# Altium schematic sheet Phase_Detector.SchDoc: Phase detector
size A3; Author: M.Beldyga; CompanyName: WUT ISE; DrawnBy: M.Beldyga; Organization: WUT ISE; Address1: PW ISE; Address2: Nowowiejska 15/19 00-665 Warsaw; Address3: micbeldyga@gmail.com; SheetNumber: 12; SheetTotal: 12; ModifiedBy: -; CheckedDate: -; DivGrp: WUT ISE; Designer: M.Beldyga; ModifiedDate: -; ProjectName: Sensor Box
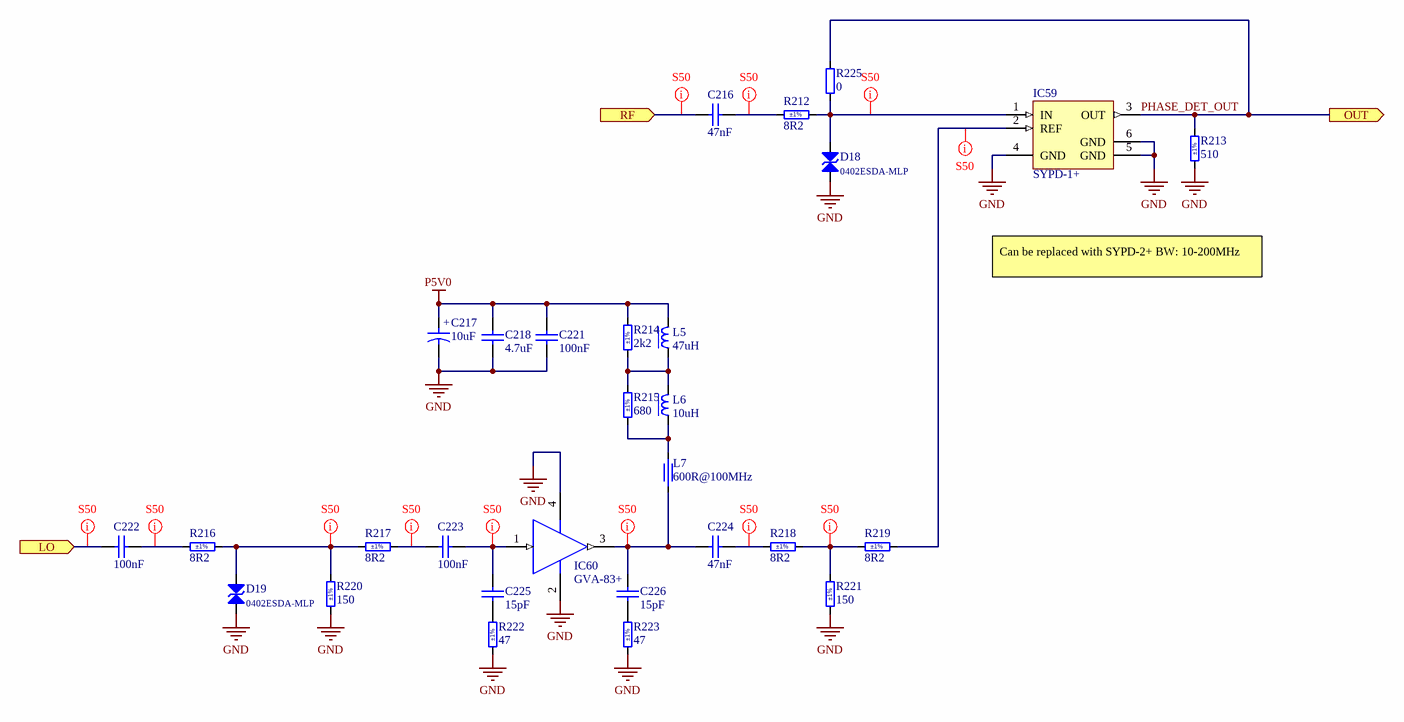
[diagram p0: Phase_Detector.SchDoc]

## Parts
C216  47nF  [CAPC1005X55N]
C217  10uF  [CAPMP3216X180N]
C218  4.7uF  [CAPC1608X90N]
C221  100nF  [CAPC1005X55N]
C222  100nF  [CAPC1005X55N]
C223  100nF  [CAPC1005X55N]
C224  47nF  [CAPC1005X55N]
C225  15pF  [CAPC1005X55N]
C226  15pF  [CAPC1005X55N]
D18  0402ESDA-MLP  [EATON_0402ESDA-MLP]
D19  0402ESDA-MLP  [EATON_0402ESDA-MLP]
IC59  SYPD-1+  [MINI-CIRCUITS_TTT167]
IC60  GVA-83+  [MINI-CIRCUITS_DF782]
L5  47uH  [IND_MURATA_LQH32C]
L6  10uH  [IND_MURATA_LQH32C]
L7  600R@100MHz  [INDC1608X95N]
R212  8R2  Tolerance: ±1%  [RESC2012X60N]
R213  510  Tolerance: ±1%  [RESC1005X40N]
R214  2k2  Tolerance: ±1%  [RESC1005X40N]
R215  680  Tolerance: ±1%  [RESC1005X40N]
R216  8R2  Tolerance: ±1%  [RESC2012X60N]
R217  8R2  Tolerance: ±1%  [RESC2012X60N]
R218  8R2  Tolerance: ±1%  [RESC2012X60N]
R219  8R2  Tolerance: ±1%  [RESC2012X60N]
R220  150  Tolerance: ±1%  [RESC2012X60N]
R221  150  Tolerance: ±1%  [RESC2012X60N]
R222  47  Tolerance: ±1%  [RESC1005X40N]
R223  47  Tolerance: ±1%  [RESC1005X40N]
R225  0  [RESC1005X40N]

## Ports
LO (in), OUT (out), RF (in)

## Nets
GND: C217.2 C218.1 C221.2 D18.1 D19.1 IC59.4(GND) IC59.5(GND) IC59.6(GND) IC60.2(GND) IC60.4(GND) R213.1 R220.1 R221.1 R222.1 R223.1
P5V0: C217.1 C218.2 C221.1 L5.2 R214.2
LO: C222.2 ; port LO
PHASE_DET_OUT: IC59.3(OUT) R213.2 R225.2 ; port OUT
RF: C216.1 ; port RF
NetC216_2: C216.2 R212.1
NetC222_1: C222.1 R216.1
NetC223_1: C223.1 C225.2 IC60.1(RF_IN)
NetC223_2: C223.2 R217.2
NetC224_1: C224.1 C226.2 IC60.3(RF_OUT) L7.1
NetC224_2: C224.2 R218.1
NetC225_1: C225.1 R222.2
NetC226_1: C226.1 R223.2
NetD18_2: D18.2 IC59.1(IN) R212.2 R225.1
NetD19_2: D19.2 R216.2 R217.1 R220.2
NetIC59_2: IC59.2(REF) R219.2
NetL5_1: L5.1 L6.2 R214.1 R215.2
NetL6_1: L6.1 L7.2 R215.1
NetR218_2: R218.2 R219.1 R221.2

## Layout directives
net class S50: LO, NetC216_2, NetC222_1, NetC223_1, NetC223_2, NetC224_1, NetC224_2, NetD18_2, NetD19_2, NetIC59_2, NetR218_2, RF

## Notes on the sheet
- Can be replaced with SYPD-2+ BW: 10-200MHz
- Project/Equipment
- Document
- Designer
- Drawn by
- Check.by
- Contact
- File
- Last Mod.
- Print Date
- Sheet
- Size
- A3
- of
- Rev
- (in symbol CTE3216-18_10UF_10V_10%_LESR1800) +

## Library data of the parts
C216 C224 = CC0402_47NF_25V_10%_X7R: Non-polarised capacitor; Part Description: SMD Multilayer Chip Ceramic Capacitor; Manufacturer: GENERIC; Manufacturer1 Part Number: C1005X7R1E473K050; Voltage: 25V; TC: X7R; Tolerance: ±10%; Part Number: CC0402_47NF_25V_10%_X7R; Component Kind: Standard; Component Type: Standard; Pin Count: 2; Value: 47nF; Status: Preferred; Manufacturer Part Number: CC0402_47NF_25V_10%_X7R; Case: 0402; Mounted: Yes; Socket: No; SMD: Yes; Sense: No; Manufacturer1 Example: TDK; Manufacturer1 ComponentHeight: 0.55mm; HelpURL: \\cern.ch\dfs\Applications\Altium\Datasheets\CC0402_X7R_TDK_C.pdf; Author: CERN DEM JLC; CreateDate: 10/25/2012; LatestRevisionDate: 10/25/2012
C217 = CTE3216-18_10UF_10V_10%_LESR1800: Polarised capacitor; Part Description: Low ESR 1R8 Solid Tantalum Chip Capacitor; Manufacturer: GENERIC; Manufacturer1 Part Number: TPSA106K010R1800; Voltage: 10V; Tolerance: ±10%; Part Number: CTE3216-18_10UF_10V_10%_LESR1800; Component Kind: Standard; Component Type: Standard; Pin Count: 2; Value: 10uF; Status: Preferred; Manufacturer Part Number: CTE3216-18_10UF_10V_10%_LESR1800; Case: A; Mounted: Yes; Socket: No; SMD: Yes; Sense: No; Manufacturer1 Example: AVX; Manufacturer1 ComponentHeight: 1.8mm; HelpURL: \\cern.ch\dfs\Applications\Altium\Datasheets\CTE-LESR_AVX_TPS.pdf; Author: CERN DEM JLC; CreateDate: 5/5/2008; LatestRevisionDate: 1/20/2009
C218 = CC0603_4.7UF_25V_10%_X5R: Non-polarised capacitor; Part Description: SMD Multilayer Chip Ceramic Capacitor; Manufacturer: GENERIC; Manufacturer1 Part Number: GRM188R61E475KE11D; Voltage: 25V; TC: X5R; Tolerance: ±10%; Part Number: CC0603_4.7UF_25V_10%_X5R; Component Kind: Standard; Component Type: Standard; Pin Count: 2; Value: 4.7uF; Status: None; Manufacturer Part Number: CC0603_4.7UF_25V_10%_X5R; Case: 0603; Mounted: Yes; Socket: No; SMD: Yes; Sense: No; Manufacturer1 Example: MURATA; Manufacturer1 ComponentHeight: 0.95mm; HelpURL: \\cern.ch\dfs\Applications\Altium\Datasheets\CC0603_MURATA_GRM188R61E475KE11D.pdf; Author: CERN DEM JLC; CreateDate: 11/10/2014; LatestRevisionDate: 11/10/2014
C221-C223 = CC0402_100NF_50V_10%_X7R: Non-polarised capacitor; Part Description: SMD Multilayer Chip Ceramic Capacitor; Manufacturer: GENERIC; Manufacturer1 Part Number: GRM155R71H104KE14D; Voltage: 50V; TC: X7R; Tolerance: ±10%; Part Number: CC0402_100NF_50V_10%_X7R; Component Kind: Standard; Component Type: Standard; Pin Count: 2; Value: 100nF; Status: None; Manufacturer Part Number: CC0402_100NF_50V_10%_X7R; Case: 0402; Mounted: Yes; Socket: No; SMD: Yes; Sense: No; Manufacturer1 Example: MURATA; Manufacturer1 ComponentHeight: 0.55mm; HelpURL: \\cern.ch\dfs\Applications\Altium\Datasheets\CC0402_MURATA_GRM155R71H104KE14D.pdf; Author: CERN DEM MR; CreateDate: 6/30/2017; LatestRevisionDate: 6/30/2017
C225 C226 = CC0402_15PF_50V_5%_C0G: Non-polarised capacitor; Part Description: SMD Multilayer Chip Ceramic Capacitor; Manufacturer: GENERIC; Manufacturer1 Part Number: C0402C150J5GACTU; Voltage: 50V; TC: C0G/NP0; Tolerance: ±5%; Part Number: CC0402_15PF_50V_5%_C0G; Component Kind: Standard; Component Type: Standard; Pin Count: 2; Value: 15pF; Status: Preferred; Manufacturer Part Number: CC0402_15PF_50V_5%_C0G; Case: 0402; Mounted: Yes; Socket: No; SMD: Yes; Sense: No; Manufacturer1 Example: KEMET; Manufacturer1 ComponentHeight: 0.55mm; HelpURL: \\cern.ch\dfs\Applications\Altium\Datasheets\CC0402_C0G_KEMET_(Commercial Grade).pdf; Author: CERN DEM JLC; CreateDate: 12/3/2007; LatestRevisionDate: 4/22/2015
D18 D19 = 0402ESDA-MLP: Transient Voltage Suppressor Diode (Bi-Directional); Part Description: 0.05pF 8kV Bidirectional ESD Voltage Suppressor; Manufacturer: EATON; Voltage: 8kV; PressFit: No; Bonding: No; Part Number: 0402ESDA-MLP; Component Kind: Standard; Component Type: Standard; Device: 0402ESDA-MLP; PackageDescription: 0402, 2-Leads, Body 1.1mm L X 0.53mm W X 0.44mm H body, IPC Medium Density; Manufacturer Part Number: 0402ESDA-MLP; Pin Count: 2; Case: 0402; Mounted: Yes; Socket: No; SMD: Yes; Sense: No; ComponentHeight: 0.44mm; HelpURL: \\cern.ch\dfs\Applications\Altium\Datasheets\0402ESDA-MLP.pdf; Author: CERN DEM MR; CreateDate: 11/22/2019; LatestRevisionDate: 11/22/2019
IC59 = SYPD-1+: 50 Ohm, 1 to 100MHz, High Output, Phase Detector; Manufacturer: MINI-CIRCUITS; Manufacturer Part Number: SYPD-1; PressFit: No; Bonding: No; Part Number: SYPD-1+; Component Kind: Standard; Component Type: Standard; Device: SYPD-1+; PackageDescription: MINI-CIRCUITS TTT167 Case, 6 pin, 9.65mm W X 12.7mm L; Part Description: 50 Ohm, 1 to 100MHz, High Output, Phase Detector; Pin Count: 6; Mounted: Yes; Socket: No; SMD: Yes; Sense: No; ComponentHeight: 5.84mm; Author: CERN DEM BC; HelpURL: \\cern.ch\dfs\Applications\Altium\Datasheets\SYPD-1+.pdf; CreateDate: 1/23/2020; LatestRevisionDate: 6/24/2022
IC60 = GVA-83+: Monolithic Amplifier DC-7 GHz; Manufacturer: Mini-Circuits; Supplier: Digikey; Supplier Part Number: 3157-GVA-83+CT-ND; Manufacturer Part Number: GVA-83+; RoHS: Yes; Category: RF Amplifiers; Stock: 563; Pricing: 1=3.04, 20=2.76, 100=2.724, 200=2.592, 500=2.5857 (USD); RoHS Compliant: Yes; ComponentLink1URL: http://datasheet.octopart.com/GVA-83%2B-Mini-Circuits-datasheet-15989876.pdf?src-supplier=Digikey; ComponentLink1Description: http://datasheet.octopart.com/GVA-83%2B-Mini-Circuits-datasheet-15989876.pdf?src-supplier=Digikey; ComponentLink2URL: http://datasheet.octopart.com/GVA-83%2B-Mini-Circuits-datasheet-15989876.pdf?src-supplier=Mouser; ComponentLink2Description: http://datasheet.octopart.com/GVA-83%2B-Mini-Circuits-datasheet-15989876.pdf?src-supplier=Mouser; ComponentLink3URL: http://datasheet.octopart.com/GVA-83%2B-Mini-Circuits-datasheet-15989876.pdf?src-supplier=Quest; ComponentLink3Description: http://datasheet.octopart.com/GVA-83%2B-Mini-Circuits-datasheet-15989876.pdf?src-supplier=Quest
L5 = IND_47UH_10%_MURATA_LQH32CN470K23L: Inductor With Core; Part Description: Chip Inductor (Chip Coil) for Choke Wire Wound Type; Manufacturer: MURATA; Power: 170mA; Resistance: 1.3R; Tolerance: ±10%; Part Number: IND_47UH_10%_MURATA_LQH32CN470K23L; Component Kind: Standard; Component Type: Standard; Pin Count: 2; Value: 47uH; Manufacturer Part Number: LQH32CN470K23; Mounted: Yes; Socket: No; SMD: Yes; Sense: No; ComponentHeight: 2.2mm; HelpURL: \\cern.ch\dfs\Applications\Altium\Datasheets\IND_MURATA_LQH32CN_23.pdf; Author: CERN DEM JLC; CreateDate: 1/20/2009; LatestRevisionDate: 7/4/2018
L6 = IND_10UH_10%_MURATA_LQH32CN100K33L: Inductor With Core; Part Description: Chip Inductor (Chip Coil) for Choke Wire Wound Type; Manufacturer: MURATA; Power: 450mA; Resistance: 0.3R; Tolerance: ±10%; Part Number: IND_10UH_10%_MURATA_LQH32CN100K33L; Component Kind: Standard; Component Type: Standard; Pin Count: 2; Value: 10uH; Manufacturer Part Number: LQH32CN100K33; Mounted: Yes; Socket: No; SMD: Yes; Sense: No; ComponentHeight: 2.2mm; HelpURL: \\cern.ch\dfs\Applications\Altium\Datasheets\IND_MURATA_LQH32CN_33.pdf; Author: CERN DEM JLC; CreateDate: 4/6/2009; LatestRevisionDate: 7/4/2018
L7 = IND0603_MURATA_BLM18BD601SN1D: Part Description: SMD EMIFIL Suppression Chip Ferrite Bead; Manufacturer: MURATA; Power: 200mA; Resistance: 0.65R; Tolerance: ±25%; Part Number: IND0603_MURATA_BLM18BD601SN1D; Component Kind: Standard; Component Type: Standard; Pin Count: 2; Value: 600R@100MHz; Manufacturer Part Number: BLM18BD601SN1D; Case: 0603; Mounted: Yes; Socket: No; SMD: Yes; Sense: No; ComponentHeight: 0.95mm; HelpURL: \\cern.ch\dfs\Applications\Altium\Datasheets\IND0603_MURATA_BLM18B.pdf; Author: CERN DEM JLC; CreateDate: 7/4/2012; LatestRevisionDate: 10/25/2018
R212 R216-R219 = R0805_8R2_1%_0.125W_200PPM: Resistor - 1%; Part Description: General Purpose Thick Film Chip Resistor; Manufacturer: GENERIC; Manufacturer1 Part Number: 232273468208L or RC0805FR-078R2L; Power: 0.125W; TC: ±200ppm/°C; PressFit: No; Part Number: R0805_8R2_1%_0.125W_200PPM; Component Kind: Standard; Component Type: Standard; Pin Count: 2; Value: 8R2; Status: Preferred; Manufacturer Part Number: R0805_8R2_1%_0.125W_200PPM; Case: 0805; Mounted: Yes; Sense: No; Socket: No; SMD: Yes; Manufacturer1 Example: YAGEO PHYCOMP; Manufacturer1 ComponentHeight: 0.65mm; HelpURL: \\cern.ch\dfs\Applications\Altium\Datasheets\R0805_Phycomp_RC0805.pdf; Author: CERN DEM JLC; CreateDate: 12/3/2007; LatestRevisionDate: 10/17/2012
R213 = R0402_510R_1%_0.0625W_100PPM: Resistor - 1%; Part Description: General Purpose Thick Film Chip Resistor; Manufacturer: GENERIC; Manufacturer1 Part Number: 232270675101L; TC: ±100ppm/°C; PressFit: No; Part Number: R0402_510R_1%_0.0625W_100PPM; Component Kind: Standard; Component Type: Standard; Pin Count: 2; Value: 510; Status: Not Recommended; Power: 0.0625W; Manufacturer Part Number: R0402_510R_1%_0.0625W_100PPM; Case: 0402; Mounted: Yes; Sense: No; Socket: No; SMD: Yes; Manufacturer1 Example: YAGEO PHYCOMP; Manufacturer1 ComponentHeight: 0.4mm; HelpURL: \\cern.ch\dfs\Applications\Altium\Datasheets\R0402_Phycomp_RC0402.pdf; Author: CERN DEM JLC; CreateDate: 12/3/2007; LatestRevisionDate: 10/17/2012
R214 = R0402_2K2_1%_0.0625W_100PPM: Resistor - 1%; Part Description: General Purpose Thick Film Chip Resistor; Manufacturer: GENERIC; Manufacturer1 Part Number: 232270672202L; TC: ±100ppm/°C; PressFit: No; Part Number: R0402_2K2_1%_0.0625W_100PPM; Component Kind: Standard; Component Type: Standard; Pin Count: 2; Value: 2k2; Status: Not Recommended; Power: 0.0625W; Manufacturer Part Number: R0402_2K2_1%_0.0625W_100PPM; Case: 0402; Mounted: Yes; Sense: No; Socket: No; SMD: Yes; Manufacturer1 Example: YAGEO PHYCOMP; Manufacturer1 ComponentHeight: 0.4mm; HelpURL: \\cern.ch\dfs\Applications\Altium\Datasheets\R0402_Phycomp_RC0402.pdf; Author: CERN DEM JLC; CreateDate: 12/3/2007; LatestRevisionDate: 10/17/2012
R215 = R0402_680R_1%_0.0625W_100PPM: Resistor - 1%; Part Description: General Purpose Thick Film Chip Resistor; Manufacturer: GENERIC; Manufacturer1 Part Number: 232270676801L; TC: ±100ppm/°C; PressFit: No; Part Number: R0402_680R_1%_0.0625W_100PPM; Component Kind: Standard; Component Type: Standard; Pin Count: 2; Value: 680; Status: Not Recommended; Power: 0.0625W; Manufacturer Part Number: R0402_680R_1%_0.0625W_100PPM; Case: 0402; Mounted: Yes; Sense: No; Socket: No; SMD: Yes; Manufacturer1 Example: YAGEO PHYCOMP; Manufacturer1 ComponentHeight: 0.4mm; HelpURL: \\cern.ch\dfs\Applications\Altium\Datasheets\R0402_Phycomp_RC0402.pdf; Author: CERN DEM JLC; CreateDate: 12/3/2007; LatestRevisionDate: 10/17/2012
R220 R221 = R0805_150R_1%_0.125W_100PPM: Resistor - 1%; Part Description: General Purpose Thick Film Chip Resistor; Manufacturer: GENERIC; Manufacturer1 Part Number: NRC10F1500TRF; Power: 0.125W; TC: ±100ppm/°C; PressFit: No; Part Number: R0805_150R_1%_0.125W_100PPM; Component Kind: Standard; Component Type: Standard; Pin Count: 2; Value: 150; Status: Preferred; Manufacturer Part Number: R0805_150R_1%_0.125W_100PPM; Case: 0805; Mounted: Yes; Sense: No; Socket: No; SMD: Yes; Manufacturer1 Example: NIC COMPONENT; Manufacturer1 ComponentHeight: 0.6mm; HelpURL: \\cern.ch\dfs\Applications\Altium\Datasheets\R0805_NIC_NRC.pdf; Author: CERN DEM JLC; CreateDate: 12/3/2007; LatestRevisionDate: 3/13/2008
R222 R223 = R0402_47R_1%_0.0625W_100PPM: Resistor - 1%; Part Description: General Purpose Thick Film Chip Resistor; Manufacturer: GENERIC; Manufacturer1 Part Number: 232270674709L; TC: ±100ppm/°C; PressFit: No; Part Number: R0402_47R_1%_0.0625W_100PPM; Component Kind: Standard; Component Type: Standard; Pin Count: 2; Value: 47; Status: Not Recommended; Power: 0.0625W; Manufacturer Part Number: R0402_47R_1%_0.0625W_100PPM; Case: 0402; Mounted: Yes; Sense: No; Socket: No; SMD: Yes; Manufacturer1 Example: YAGEO PHYCOMP; Manufacturer1 ComponentHeight: 0.4mm; HelpURL: \\cern.ch\dfs\Applications\Altium\Datasheets\R0402_Phycomp_RC0402.pdf; Author: CERN DEM JLC; CreateDate: 12/3/2007; LatestRevisionDate: 10/17/2012
R225 = R0402_0R_JUMPER: Resistor; Part Description: 1A (0.05R Max DC Resistance) Zero Ohm Jumper; Manufacturer: GENERIC; Manufacturer1 Part Number: 232270591001L; PressFit: No; Part Number: R0402_0R_JUMPER; Component Kind: Standard; Component Type: Standard; Pin Count: 2; Value: 0; Status: Not Recommended; Manufacturer Part Number: R0402_0R_JUMPER; Case: 0402; Mounted: Yes; Sense: No; Socket: No; SMD: Yes; Manufacturer1 Example: YAGEO PHYCOMP; Manufacturer1 ComponentHeight: 0.4mm; HelpURL: \\cern.ch\dfs\Applications\Altium\Datasheets\R0402_Phycomp_RC0402.pdf; Author: CERN DEM JLC; CreateDate: 12/3/2007; LatestRevisionDate: 10/17/2012